# Altium project PCB_Project.PrjPcb
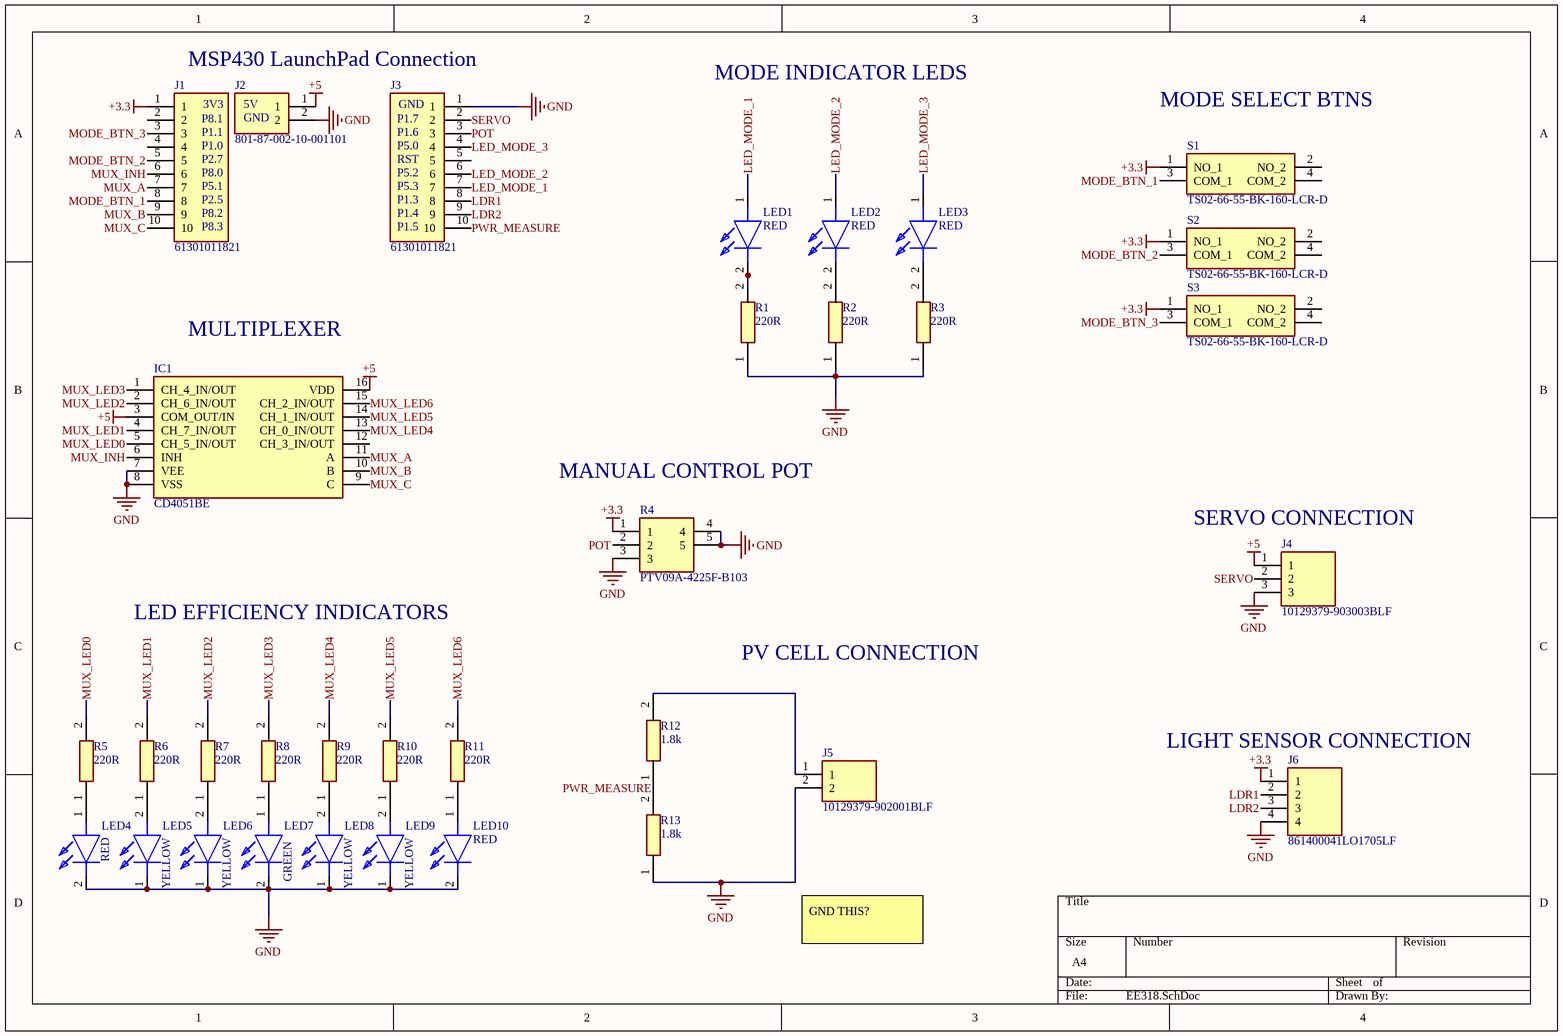
[diagram p0: EE318.SchDoc]
1 sheet, 33 parts. Net scope: global (net labels, ports and power ports of the same name join across sheets).
Board file: EE318.PcbDoc

## Sheet EE318.SchDoc
size A4; SheetNumber: 1; SheetTotal: 1

### Parts
IC1  CD4051BE  [DIP794W53P254L1930H508Q16N]
J1  61301011821  [RHDR10W60P0X254_1X10_2590X250X850P]
J2  801-87-002-10-001101  [RHDR2W60P0X254_1X2_508X254X700P]
J3  61301011821  [RHDR10W60P0X254_1X10_2590X250X850P]
J4  10129379-903003BLF  [10129379903003BLF]
J5  10129379-902001BLF  [HDRRA2W67P0X254_1X2_508X254X241P]
J6  861400041LO1705LF  [HDRRA4W63P0X254_1X4_1016X260X264P]
LED1  RED  [C503BRCNCW0Z0AA2]
LED2  RED  [C503BRCNCW0Z0AA2]
LED3  RED  [C503BRCNCW0Z0AA2]
LED4  RED  [C503BRCNCW0Z0AA2]
LED5  YELLOW  [151051YS04000]
LED6  YELLOW  [151051YS04000]
LED7  GREEN  [C503BGANCB0F0791]
LED8  YELLOW  [151051YS04000]
LED9  YELLOW  [151051YS04000]
LED10  RED  [C503BRCNCW0Z0AA2]
R1  220R  [RESC3116X65N]
R2  220R  [RESC3116X65N]
R3  220R  [RESC3116X65N]
R4  PTV09A-4225F-B103  [PTV09A4020FB103]
R5  220R  [RESC3116X65N]
R6  220R  [RESC3116X65N]
R7  220R  [RESC3116X65N]
R8  220R  [RESC3116X65N]
R9  220R  [RESC3116X65N]
R10  220R  [RESC3116X65N]
R11  220R  [RESC3116X65N]
R12  1.8k  [RESC3116X65N]
R13  1.8k  [RESC3116X65N]
S1  TS02-66-55-BK-160-LCR-D  [TS026655BK160LCRD]
S2  TS02-66-55-BK-160-LCR-D  [TS026655BK160LCRD]
S3  TS02-66-55-BK-160-LCR-D  [TS026655BK160LCRD]

### Nets
+3.3: J1.1 J6.1 R4.1 S1.1(NO_1) S2.1(NO_1) S3.1(NO_1)
+5: IC1.3(COM_OUT/IN) IC1.16(VDD) J2.1 J4.1
GND: IC1.7(VEE) IC1.8(VSS) J2.2 J3.1 J4.3 J5.2 J6.4 LED4.2(K) LED5.1(K) LED6.1(K) LED7.2(K) LED8.1(K) LED9.1(K) LED10.2(K) R1.1 R2.1 R3.1 R4.3 R4.4 R4.5 R13.1
LDR1: J3.8 J6.2
LDR2: J3.9 J6.3
LED_MODE_1: J3.7 LED1.1(A)
LED_MODE_2: J3.6 LED2.1(A)
LED_MODE_3: J3.4 LED3.1(A)
MODE_BTN_1: J1.8 S1.3(COM_1)
MODE_BTN_2: J1.5 S2.3(COM_1)
MODE_BTN_3: J1.3 S3.3(COM_1)
MUX_A: IC1.11(A) J1.7
MUX_B: IC1.10(B) J1.9
MUX_C: IC1.9(C) J1.10
MUX_INH: IC1.6(INH) J1.6
MUX_LED0: IC1.5(CH_5_IN/OUT) R5.2
MUX_LED1: IC1.4(CH_7_IN/OUT) R6.2
MUX_LED2: IC1.2(CH_6_IN/OUT) R7.2
MUX_LED3: IC1.1(CH_4_IN/OUT) R8.2
MUX_LED4: IC1.13(CH_0_IN/OUT) R9.2
MUX_LED5: IC1.14(CH_1_IN/OUT) R10.2
MUX_LED6: IC1.15(CH_2_IN/OUT) R11.2
POT: J3.3 R4.2
PWR_MEASURE: J3.10 R12.1 R13.2
SERVO: J3.2 J4.2
NetJ5_1: J5.1 R12.2
NetLED1_2: LED1.2(K) R1.2
NetLED2_2: LED2.2(K) R2.2
NetLED3_2: LED3.2(K) R3.2
NetLED4_1: LED4.1(A) R5.1
NetLED5_2: LED5.2(A) R6.1
NetLED6_2: LED6.2(A) R7.1
NetLED7_1: LED7.1(A) R8.1
NetLED8_2: LED8.2(A) R9.1
NetLED9_2: LED9.2(A) R10.1
NetLED10_1: LED10.1(A) R11.1

Not connected (* = marked no-connect by the designer): IC1 12(CH_3_IN/OUT); J1 2 4; J3 5; S1 2(NO_2) 4(COM_2); S2 2(NO_2) 4(COM_2); S3 2(NO_2) 4(COM_2)

### Notes on the sheet
- MSP430 LaunchPad Connection
- (near J1) 3V3
- (near J2) 5V
- (near J3) GND
- MODE INDICATOR LEDS
- MODE SELECT BTNS
- (near J1) P8.1
- (near J1) P1.1
- (near J1) P1.0
- (near J1) P2.7
- (near J1) P8.0
- (near J2) GND
- (near J3) P1.7
- (near J3) P1.6
- (near J3) P5.0
- (near J3) RST
- (near J3) P5.2
- (near J1) P5.1
- (near J1) P8.2
- (near J1) P8.3
- (near J1) P2.5
- (near J3) P5.3
- (near J3) P1.4
- (near J3) P1.5
- (near J3) P1.3
- (near IC1) MULTIPLEXER
- (near R4) MANUAL CONTROL POT
- (near J4) SERVO CONNECTION
- LED EFFICIENCY INDICATORS
- PV CELL CONNECTION
- (near J6) LIGHT SENSOR CONNECTION
- GND THIS?

### Library data of the parts
IC1 = CD4051BE: Multiplexer; Manufacturer_Name: Texas Instruments; Datasheet Link: http://www.ti.com/lit/ds/symlink/cd4051b.pdf; Height: 5.08mm; Manufacturer_Part_Number: CD4051BE; Mouser Part Number: 595-CD4051BE; Mouser Price/Stock: https://www.mouser.co.uk/ProductDetail/Texas-Instruments/CD4051BE?qs=q2XTDbzbm6DxulBsMcV7tA%3D%3D; Arrow Part Number: CD4051BE; Arrow Price/Stock: https://www.arrow.com/en/products/cd4051be/texas-instruments?region=nac
J1 J3 = 61301011821: Connector; Manufacturer_Name: Wurth Elektronik; Datasheet Link: http://katalog.we-online.de/em/datasheet/6130xx11821.pdf; Height: 8.5mm; Manufacturer_Part_Number: 61301011821; Mouser Part Number: 710-61301011821; Mouser Price/Stock: https://www.mouser.co.uk/ProductDetail/Wurth-Elektronik/61301011821?qs=W%252B2sBeLta1ZhlLR0YCzonQ%3D%3D
J2 = 801-87-002-10-001101: Connector; Manufacturer_Name: Preci-Dip; Datasheet Link: http://www.precidip.com/AppHost/9696,1/Scripts/Modules/Catalog/Default.aspx?c=7&i=310&p=107&pdf=1&dsku=801-PP-NNN-10-001101; Height: 7mm; Manufacturer_Part_Number: 801-87-002-10-001101; Mouser Part Number: 437-8018700210001101; Mouser Price/Stock: https://www.mouser.com/Search/Refine.aspx?Keyword=437-8018700210001101
J4 = 10129379-903003BLF: Connector; Manufacturer_Name: Amphenol Communications Solutions; Datasheet Link: https://cdn.amphenol-cs.com/media/wysiwyg/files/drawing/10129379.pdf; Height: 2.41mm; Manufacturer_Part_Number: 10129379-903003BLF; Mouser Part Number: 649-1012937990303BLF; Mouser Price/Stock: https://www.mouser.co.uk/ProductDetail/Amphenol-FCI/10129379-903003BLF?qs=0lQeLiL1qya1UBwARe4kTQ%3D%3D
J5 = 10129379-902001BLF: Connector; Manufacturer_Name: Amphenol Communications Solutions; Datasheet Link: https://cdn.amphenol-cs.com/media/wysiwyg/files/drawing/10129379.pdf; Height: 2.41mm; Manufacturer_Part_Number: 10129379-902001BLF; Mouser Part Number: 649-1012937990201BLF; Mouser Price/Stock: https://www.mouser.co.uk/ProductDetail/Amphenol-FCI/10129379-902001BLF?qs=0lQeLiL1qyaP31CJBOzNsg%3D%3D; Arrow Part Number: 10129379-902001BLF; Arrow Price/Stock: https://www.arrow.com/en/products/10129379-902001blf/amphenol-fci?region=nac
J6 = 861400041LO1705LF: Connector; Manufacturer_Name: Amphenol Communications Solutions; Datasheet Link: https://cdn.amphenol-cs.com/media/wysiwyg/files/drawing/c-8614-0136.pdf; Height: 2.64mm; Manufacturer_Part_Number: 861400041LO1705LF; Mouser Part Number: 649-86140041LO1705LF; Mouser Price/Stock: https://www.mouser.co.uk/ProductDetail/Amphenol-FCI/861400041LO1705LF?qs=7JiUwvV4mh6qwBpNV5AhhA%3D%3D
LED1-LED4 LED10 = C503B-RCN-CW0Z0AA2: LED; Manufacturer_Name: Wolfspeed; Datasheet Link: https://www.cree.com/led-components/media/documents/C503B-RAS-RAN-AAS-AAN-RBS-RBN-ABS-ABN-RCS-RCN-ACS-ACN-1079.pdf; Height: 10.3mm; Manufacturer_Part_Number: C503B-RCN-CW0Z0AA2; Mouser Part Number: 941-C503BRCNCW0Z0AA2; Mouser Price/Stock: https://www.mouser.co.uk/ProductDetail/Cree-LED/C503B-RCN-CW0Z0AA2?qs=D3QG1iK7Fqi9NpEpLN2Agw%3D%3D; Arrow Part Number: C503B-RCN-CW0Z0AA2; Arrow Price/Stock: https://www.arrow.com/en/products/c503b-rcn-cw0z0aa2/cree-led?region=nac
LED5 LED6 LED8 LED9 = 151051YS04000: LED; Manufacturer_Name: Wurth Elektronik; Datasheet Link: https://katalog.we-online.de/led/datasheet/151051YS04000.pdf; Height: 8.95mm; Manufacturer_Part_Number: 151051YS04000; Mouser Part Number: 710-151051YS04000; Mouser Price/Stock: https://www.mouser.co.uk/ProductDetail/Wurth-Elektronik/151051YS04000?qs=LlUlMxKIyB0Q49NwiX6stg%3D%3D
LED7 = C503B-GAN-CB0F0791: LED; Manufacturer_Name: Wolfspeed; Datasheet Link: https://www.cree.com/led-components/media/documents/1300-C503B-BAS-BAN-GAS-GAN.pdf; Height: 10.55mm; Manufacturer_Part_Number: C503B-GAN-CB0F0791; Mouser Part Number: 941-C503BGANCB0F0791; Mouser Price/Stock: https://www.mouser.co.uk/ProductDetail/Cree-LED/C503B-GAN-CB0F0791?qs=UHyCXFkX5Ey%252ByHW9bNI8Ew%3D%3D; Arrow Part Number: C503B-GAN-CB0F0791; Arrow Price/Stock: https://www.arrow.com/en/products/c503b-gan-cb0f0791/cree
R1-R3 R5-R13 = CRS1206QFX-1002ELF: Resistor; Manufacturer_Name: Bourns; Datasheet Link: http://www.bourns.com/docs/Product-Datasheets/CRS-Q.pdf; Height: 0.65mm; Manufacturer_Part_Number: CRS1206QFX-1002ELF; Mouser Part Number: 652-CRS1206QFX-1002E; Mouser Price/Stock: https://www.mouser.co.uk/ProductDetail/Bourns/CRS1206QFX-1002ELF?qs=8Wlm6%252BaMh8QKdvkWTPthtg%3D%3D
R4 = PTV09A-4225F-B103: Potentiometer; Manufacturer_Name: Bourns; Allied_Number: 71279417; Datasheet Link: http://uk.rs-online.com/web/p/products/8274990P; Height: 20mm; RS Part Number: 8274990P; RS Price/Stock: http://uk.rs-online.com/web/p/products/8274990P; Manufacturer_Part_Number: PTV09A-4225F-B103
S1-S3 = TS02-66-55-BK-160-LCR-D: Switch; Manufacturer_Name: CUI Devices; Datasheet Link: https://www.cuidevices.com/product/resource/ts02.pdf; Height: 5.7mm; Manufacturer_Part_Number: TS02-66-55-BK-160-LCR-D; Mouser Part Number: 179-TS026655BK160LCR; Mouser Price/Stock: https://www.mouser.co.uk/ProductDetail/CUI-Devices/TS02-66-55-BK-160-LCR-D?qs=A6eO%252BMLsxmRHvFZWtBPtJQ%3D%3D; Arrow Part Number: TS02-66-55-BK-160-LCR-D; Arrow Price/Stock: https://www.arrow.com/en/products/ts02-66-55-bk-160-lcr-d/cui-devices?region=nac